# EAGLE design Smartboot Prototype_version_4 (EAGLE 6.2)

## Sheet 1 of 2
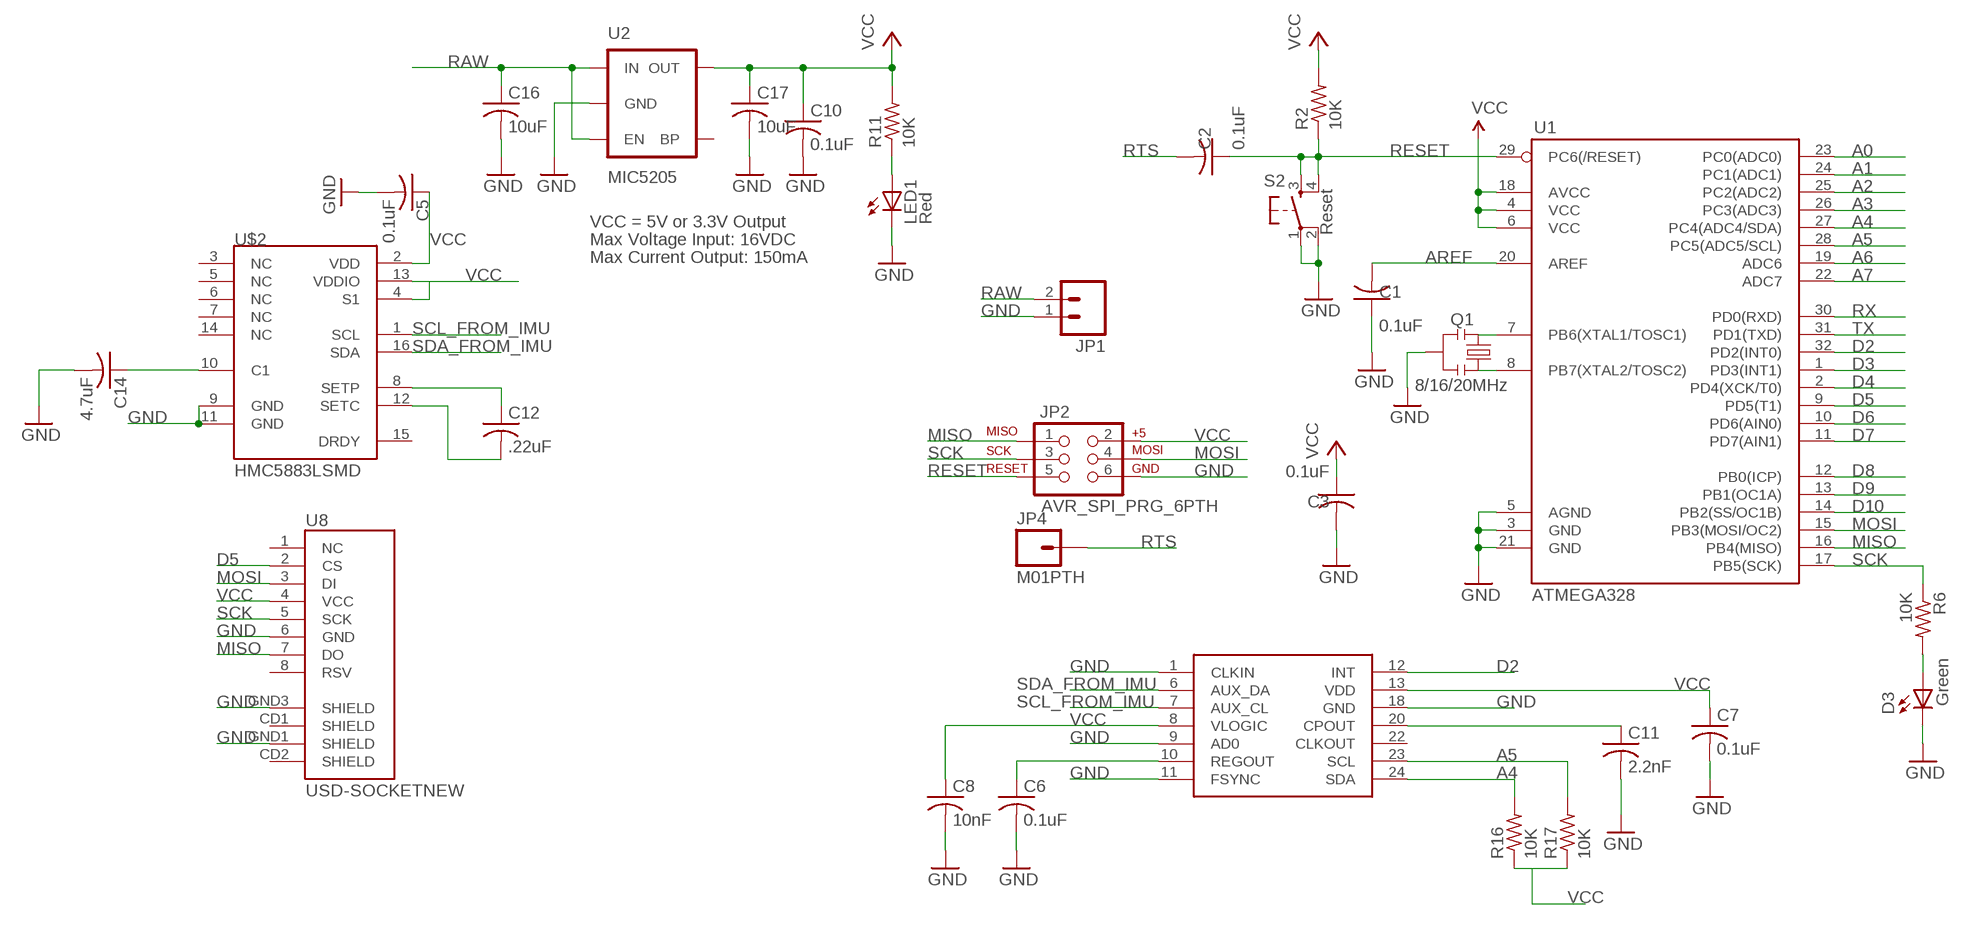
[diagram p0: schematic, sheet 1]

### Parts
C1  0.1uF  C-USC0603  [C0603]
C2  0.1uF  C-USC0603  [C0603]
C3  0.1uF  C-USC0603  [C0603]
C5  0.1uF  C-USC0603  [C0603]
C6  0.1uF  C-USC0603  [C0603]
C7  0.1uF  C-USC0603  [C0603]
C8  10nF  C-USC0603  [C0603]
C10  0.1uF  C-USC0603  [C0603]
C11  2.2nF  C-USC0603  [C0603]
C12  .22uF  C-USC0603  [C0603]
C14  4.7uF  C-USC0603  [C0603]
C16  10uF  C-USC0603  [C0603]
C17  10uF  C-USC0603  [C0603]
D3  Green  LED0603  [LED-0603]
JP1  M02-JST-2MM-SMT  [JST-2-SMD]
JP2  AVR_SPI_PRG_6PTH  [2X3]
JP4  M01PTH  [1X01]
LED1  Red  LED0603  [LED-0603]
Q1  8/16/20MHz  RESONATORSMD  [RESONATOR-SMD]
R2  10K  R-US_R0603  [R0603]
R6  10K  R-US_R0603  [R0603]
R11  10K  R-US_R0603  [R0603]
R16  10K  R-US_R0603  [R0603]
R17  10K  R-US_R0603  [R0603]
S2  Reset  TAC_SWITCHSMD  [TACTILE_SWITCH_SMD]
U1  ATMEGA328  ATMEGA168  [TQFP32-08]
U2  MIC5205  V_REG_LDOSMD  [SOT23-5]
U8  USD-SOCKETNEW  [MICRO-SD-SOCKET-PP]
U$2  HMC5883LSMD  [16LPCC]
U$5  MPU-6050A  [QFN-24-NP]

### Nets
A0: U1.23(PC0(ADC0))
A1: U1.24(PC1(ADC1))
A2: U1.25(PC2(ADC2))
A3: U1.26(PC3(ADC3))
A4: R16.2 U1.27(PC4(ADC4/SDA)) U$5.24(SDA)
A5: R17.2 U1.28(PC5(ADC5/SCL)) U$5.23(SCL)
A6: U1.19(ADC6)
A7: U1.22(ADC7)
AREF: C1.2 U1.20(AREF)
D2: U1.32(PD2(INT0)) U$5.12(INT)
D3: U1.1(PD3(INT1))
D4: U1.2(PD4(XCK/T0))
D5: U1.9(PD5(T1)) U8.2(CS)
D6: U1.10(PD6(AIN0))
D7: U1.11(PD7(AIN1))
D8: U1.12(PB0(ICP))
D9: U1.13(PB1(OC1A))
D10: U1.14(PB2(SS/OC1B))
GND [vcc]: C1.1 C3.2 C5.2 C6.2 C7.2 C8.2 C10.2 C11.2 C14.2 C16.2 C17.2 D3.C JP1.1 JP2.6 LED1.C Q1.2 S2.1 S2.2 U1.3(GND) U1.5(AGND) U1.21(GND) U2.2(GND) U8.6(GND) U8.GND1(SHIELD) U8.GND3(SHIELD) U$2.9(GND) U$2.11(GND) U$5.1(CLKIN) U$5.9(AD0) U$5.11(FSYNC) U$5.18(GND) ; also sheet 2
MISO: JP2.1 U1.16(PB4(MISO)) U8.7(DO)
MOSI: JP2.4 U1.15(PB3(MOSI/OC2)) U8.3(DI)
N$1: Q1.1 U1.8(PB7(XTAL2/TOSC2))
N$2: Q1.3 U1.7(PB6(XTAL1/TOSC1))
N$7: D3.A R6.2
N$8: C12.1 U$2.8(SETP)
N$9: C12.2 U$2.12(SETC)
N$10: C14.1 U$2.10(C1)
N$16: C6.1 U$5.10(REGOUT)
N$21: C11.1 U$5.20(CPOUT)
N$38: LED1.A R11.1
RAW [vcc]: C16.1 JP1.2 U2.1(IN) U2.3(EN) ; also sheet 2
RESET: C2.1 JP2.5 R2.1 S2.3 S2.4 U1.29(PC6(/RESET))
RTS: C2.2 JP4.1 ; also sheet 2
RX: U1.30(PD0(RXD)) ; also sheet 2
SCK: JP2.3 R6.1 U1.17(PB5(SCK)) U8.5(SCK)
SCL_FROM_IMU: U$2.1(SCL) U$5.7(AUX_CL)
SDA_FROM_IMU: U$2.16(SDA) U$5.6(AUX_DA)
TX: U1.31(PD1(TXD)) ; also sheet 2
VCC: C3.1 C5.1 C7.1 C8.1 C10.1 C17.1 JP2.2 R2.2 R11.2 R16.1 R17.1 U1.4(VCC) U1.6(VCC) U1.18(AVCC) U2.5(OUT) U8.4(VCC) U$2.2(VDD) U$2.4(S1) U$2.13(VDDIO) U$5.8(VLOGIC) U$5.13(VDD) ; also sheet 2
Unconnected: U2.4(BP) U8.1(NC) U8.8(RSV) U8.CD1(SHIELD) U8.CD2(SHIELD) U$2.3(NC) U$2.5(NC) U$2.6(NC) U$2.7(NC) U$2.14(NC) U$2.15(DRDY) U$5.22(CLKOUT)

### Notes on the sheet
- VCC = 5V or 3.3V Output
- Max Voltage Input: 16VDC
- Max Current Output: 150mA

## Sheet 2 of 2
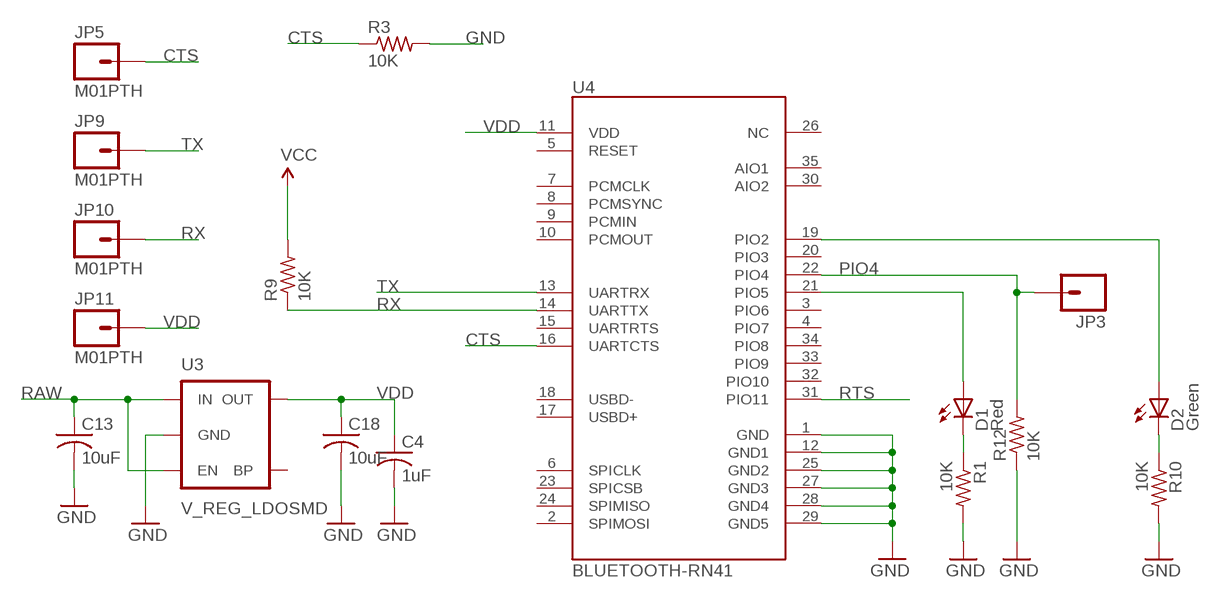
[diagram p1: schematic, sheet 2]

### Parts
C4  1uF  C-USC0603  [C0603]
C13  10uF  C-USC0603  [C0603]
C18  10uF  C-USC0603  [C0603]
D1  Red  LED0603  [LED-0603]
D2  Green  LED0603  [LED-0603]
JP3  M01SMDNS  [1X01NS]
JP5  M01PTH  [1X01]
JP9  M01PTH  [1X01]
JP10  M01PTH  [1X01]
JP11  M01PTH  [1X01]
R1  10K  R-US_R0603  [R0603]
R3  10K  R-US_R0603  [R0603]
R9  10K  R-US_R0603  [R0603]
R10  10K  R-US_R0603  [R0603]
R12  10K  R-US_R0603  [R0603]
U3  V_REG_LDOSMD  [SOT23-5]
U4  BLUETOOTH-RN41  BLUETOOTH-RN41"  [RN41]

### Nets
CTS: JP5.1 R3.1 U4.16(UARTCTS)
D1: D1.C R1.1
D11: D2.C R10.1
GND [vcc]: C4.2 C13.2 C18.2 R1.2 R3.2 R10.2 R12.1 U3.2(GND) U4.1(GND) U4.12(GND1) U4.25(GND2) U4.27(GND3) U4.28(GND4) U4.29(GND5) ; also sheet 1
N$3: D1.A U4.21(PIO5)
N$4: D2.A U4.19(PIO2)
PIO4: JP3.1 R12.2 U4.22(PIO4)
RAW [vcc]: C13.1 U3.1(IN) U3.3(EN) ; also sheet 1
RTS: U4.31(PIO11) ; also sheet 1
RX: JP10.1 R9.1 U4.14(UARTTX) ; also sheet 1
TX: JP9.1 U4.13(UARTRX) ; also sheet 1
VCC: R9.2 ; also sheet 1
VDD: C4.1 C18.1 JP11.1 U3.5(OUT) U4.11(VDD)
Unconnected: U3.4(BP) U4.2(SPIMOSI) U4.3(PIO6) U4.4(PIO7) U4.5(RESET) U4.6(SPICLK) U4.7(PCMCLK) U4.8(PCMSYNC) U4.9(PCMIN) U4.10(PCMOUT) U4.15(UARTRTS) U4.17(USBD+) U4.18(USBD-) U4.20(PIO3) U4.23(SPICSB) U4.24(SPIMISO) U4.26(NC) U4.30(AIO2) U4.32(PIO10) U4.33(PIO9) U4.34(PIO8) U4.35(AIO1)

## Library data of the parts
C1-C8 C10-C14 C16-C18 = resistor:C-US: CAPACITOR, American symbol
D1-D3 LED1 = SparkFun:LED: LEDs Standard schematic elements and footprints for 5mm, 3mm, 1206, and 0603 sized LEDs. 5mm - Spark Fun Electronics SKU : COM-00529 (and others)
JP1 = SparkFun-Connectors:M02: Header 2 Standard 2-pin 0.1" header. Use with straight break away headers (SKU : PRT-00116), right angle break away headers (PRT-00553), swiss pins (PRT-00743), machine pins (PRT-00117), and female headers (PRT-00115). Molex polarized connector foot print use with SKU : PRT-08233 with associated crimp pins and housings.
JP2 = SparkFun-Connectors:AVR_SPI_PRG_6: AVR ISP 6 Pin This is the reduced ISP connector for AVR programming. Common on Arduino. This footprint will take up less PCB space and can be used with a 10-pin to 6-pin adapter such as SKU: BOB-08508
JP3 = SparkFun:M01: Header 1 Standard 1-pin 0.1" header. Use with straight break away headers (SKU : PRT-00116), right angle break away headers (PRT-00553), swiss pins (PRT-00743), machine pins (PRT-00117), and female headers (PRT-00115).
JP4 JP5 JP9-JP11 = SparkFun-Connectors:M01: Header 1 Standard 1-pin 0.1" header. Use with straight break away headers (SKU : PRT-00116), right angle break away headers (PRT-00553), swiss pins (PRT-00743), machine pins (PRT-00117), and female headers (PRT-00115).
Q1 = SparkFun:RESONATOR: Resonator Small SMD resonator. This is the itty bitty 10/20MHz resonators with built in caps. CSTCE10M0G55 and CSTCE20M0V53. Footprint has been reviewed closely but hasn't been tested yet.
R1-R3 R6 R9-R12 R16 R17 = resistor:R-US_: RESISTOR, American symbol
S2 = SparkFun:TAC_SWITCH: Momentary Switch Button commonly used for reset or general input. Spark Fun Electronics SKU : COM-00097
U1 = SparkFun:ATMEGA168
U2 U3 = SparkFun:V_REG_LDO: Voltage Regulator LDO Standard 150mA LDO voltage regulator in SOT-23 layout. Micrel part MIC5205. BP (by-pass) pin is used to lower output noise with 470pF cap.
U4 = ScratchPad:BLUETOOTH-RN41
U8 = SparkFun-Connectors:USD-SOCKET: microSD Socket Push-push type uSD socket. Schematic element and footprint production proven. Spark Fun Electronics SKU : PRT-00127. tDoc lines correctly indicate media card edge positions when inserting (unlocked, locked, depressed).
U$2 = SparkFun-Sensors:HMC5883L: 3 Axis Digital Compass IC
U$5 = SparkFun-Sensors:MPU-6050A

## Net classes
0 default: width 0.203 mm
1 vcc: width 0.254 mm

## Board
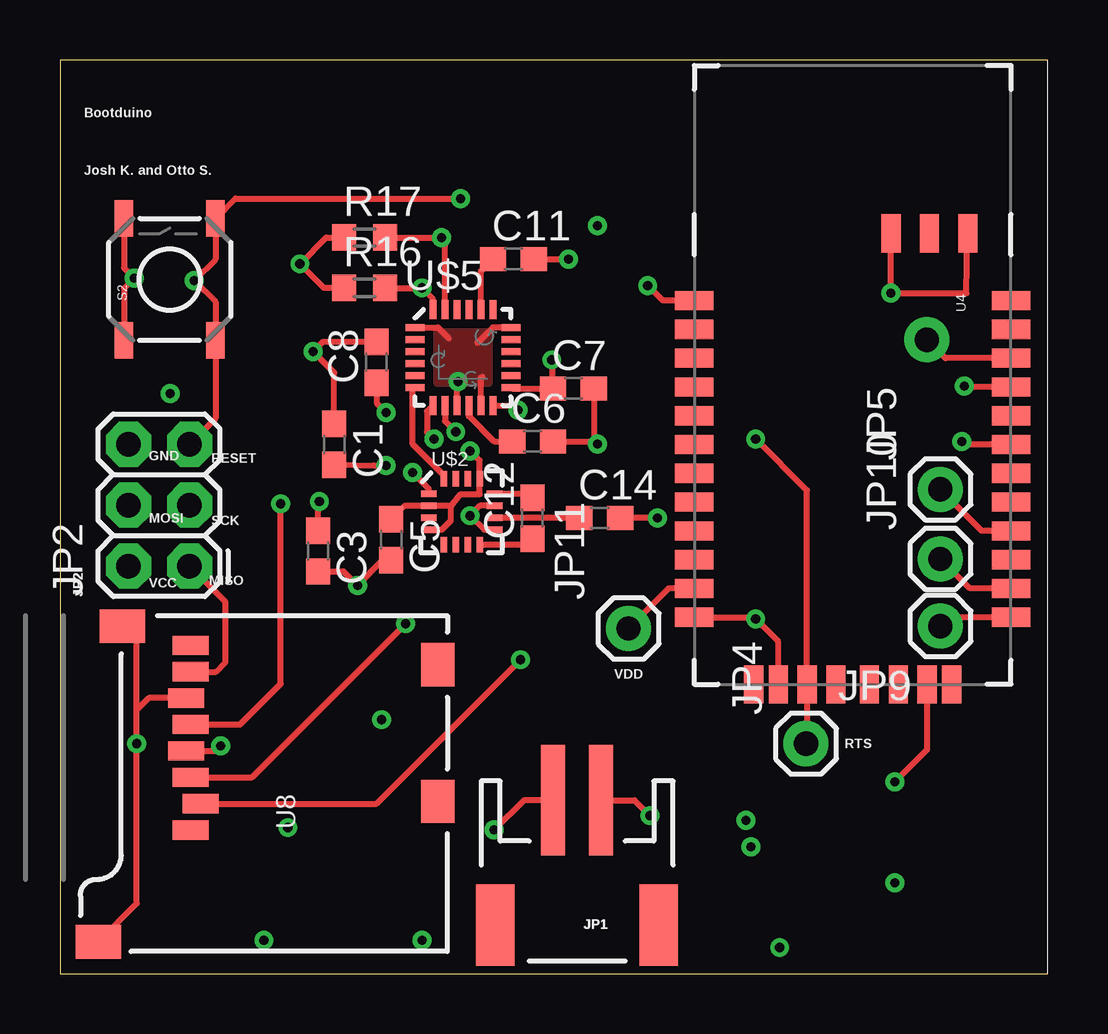
[diagram p2: board, top side]
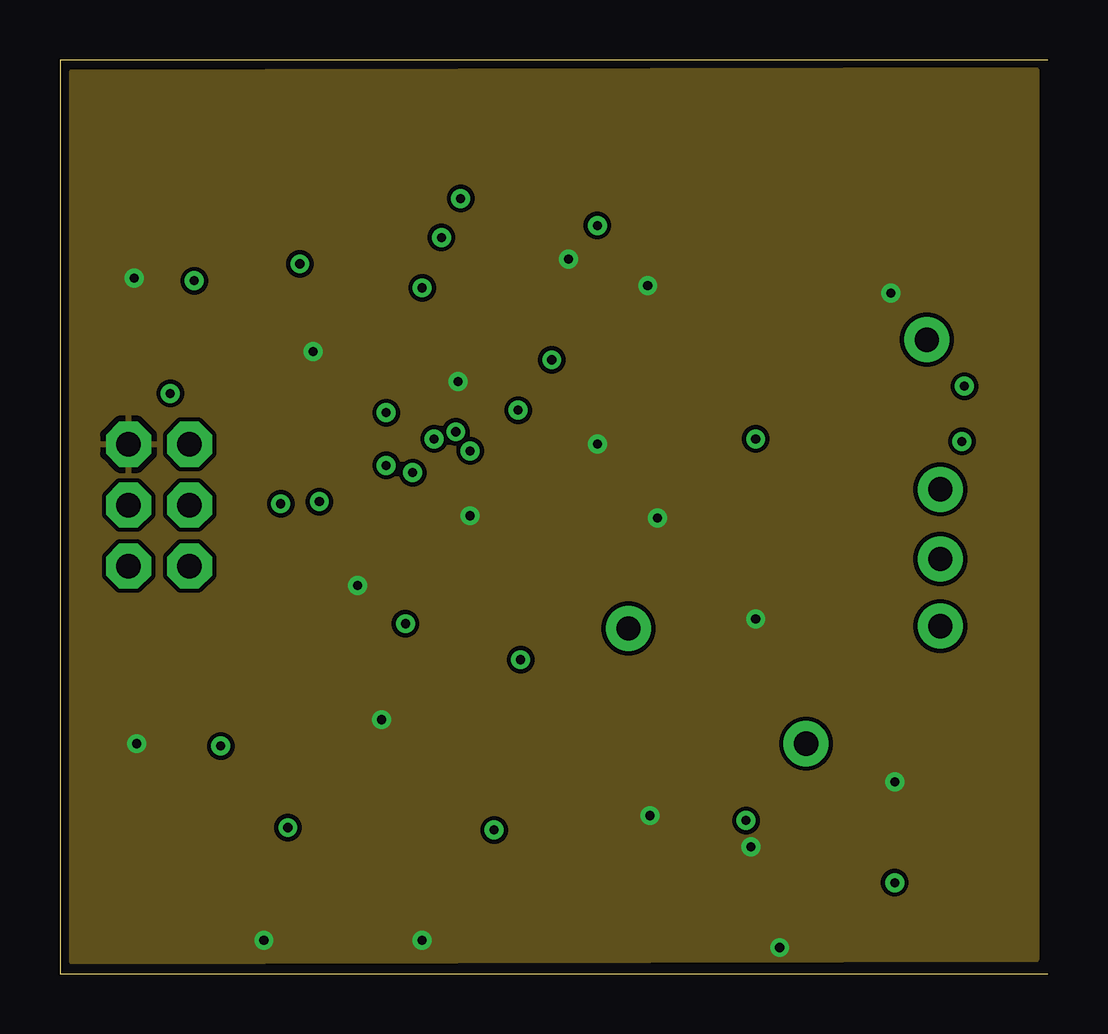
[diagram p3: board, inner layer Route2]
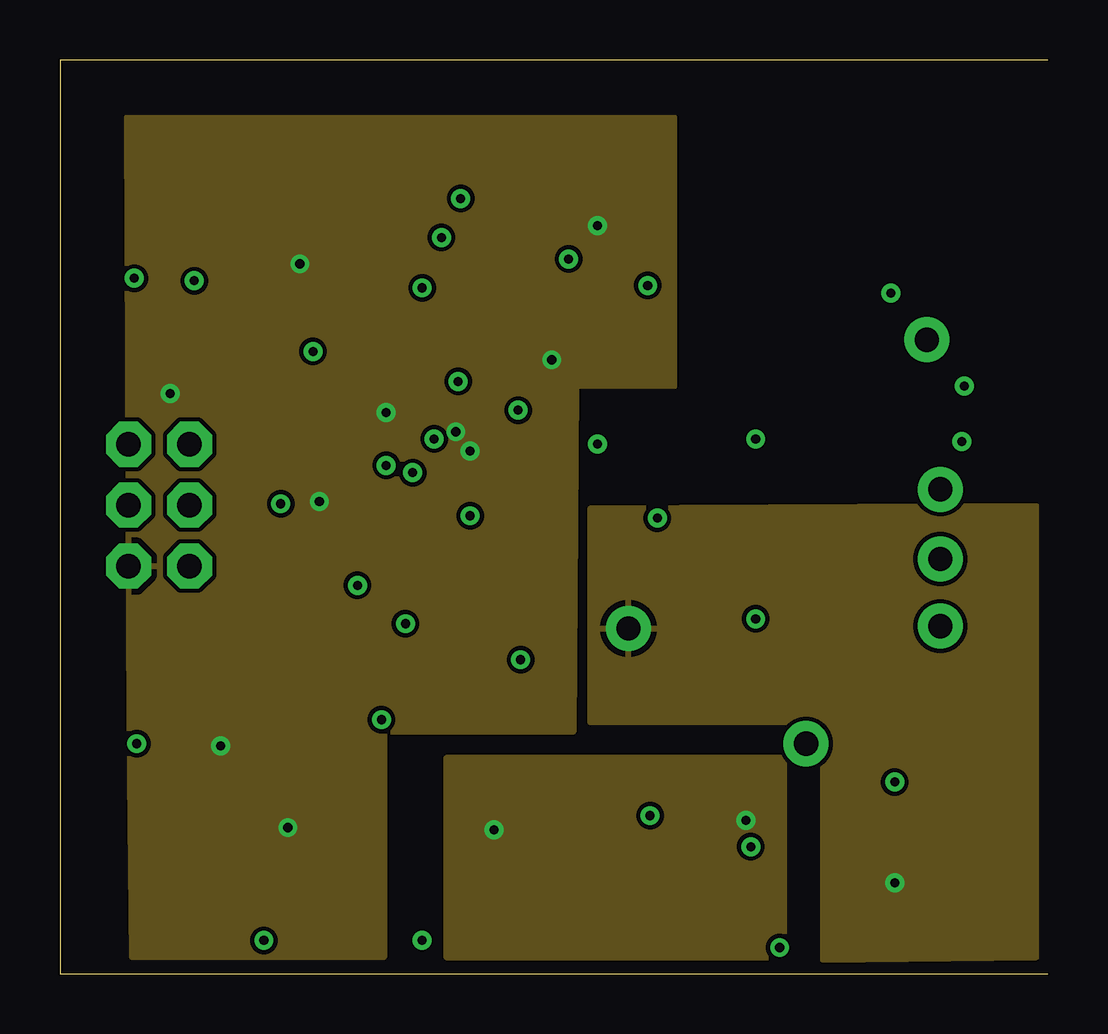
[diagram p4: board, inner layer Route15]
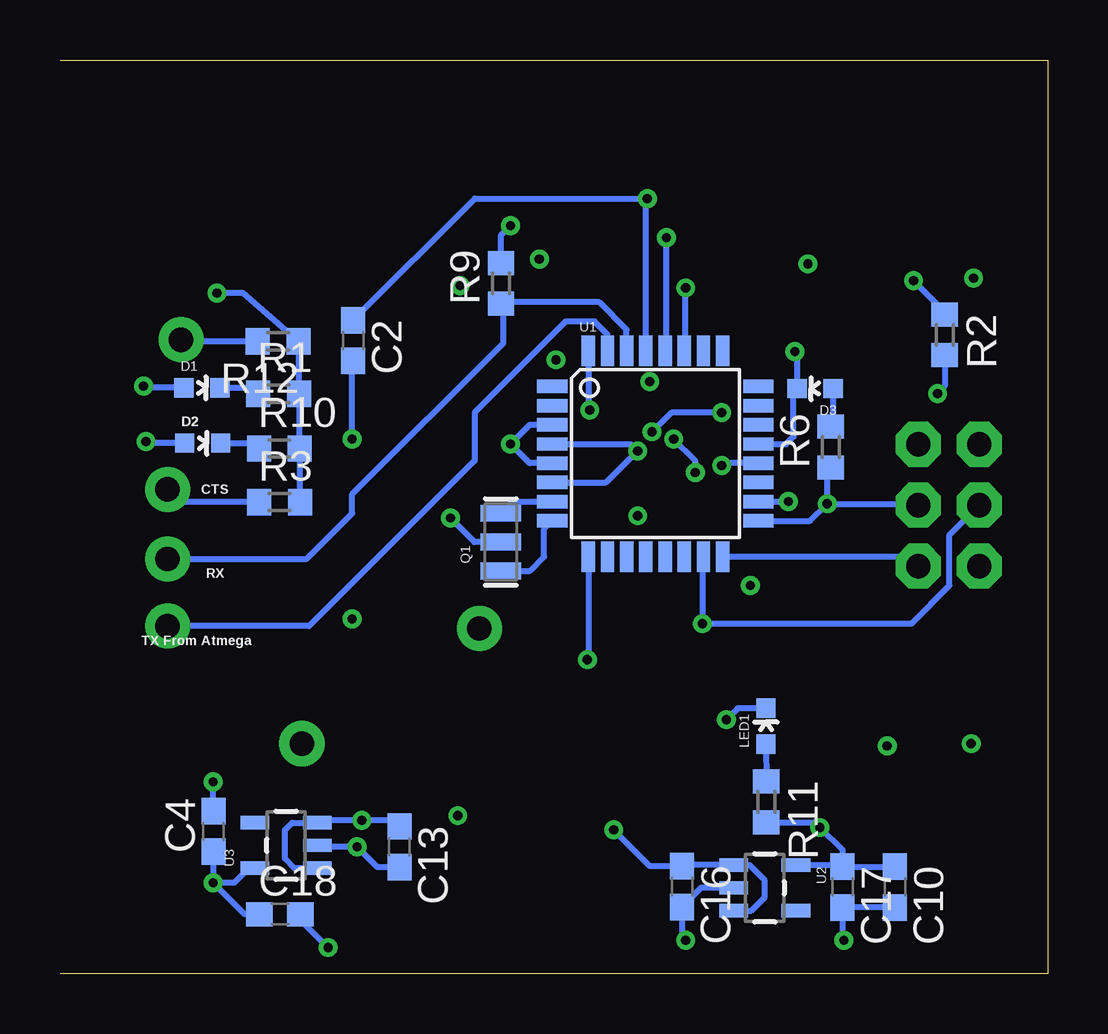
[diagram p5: board, bottom side, seen from below]

Size 41.18 x 38.1 mm. Coordinates in mm from the lower left corner, seen from the top.
Outline: 41.18,0 0,0 0,38.1 41.18,38.1
Copper layers (1*2+15*16): Top 0.035mm / dielectric 25mil / Route2 0.035mm / dielectric 25mil / Route15 0.035mm / dielectric 25mil / Bottom 0.035mm
Design rules: minimum track width 7mil, minimum drill 15mil, track to track 7mil, track to pad 6mil, pad to pad 6mil, via to via 6mil, smd to smd 6mil, copper to edge 10mil, drill to drill 10mil, minimum pad ring 10mil, minimum via ring 8mil, stop-mask expansion 4mil, vias tented up to drill 0mil, thermal gap 10mil

### Footprints (pad centres in the part's own frame; a part is rotated, then mirrored left to right if it is on the bottom)
C0603 = smd 1.1 x 1: 1 -0.85,0; 2 0.85,0
LED-0603 = smd 0.8 x 0.8: A 0,-0.75; C 0,0.75
JST-2-SMD = smd 1 x 4.6: 1 -1,-3.7; 2 1,-3.7 | smd 1.6 x 3.4: NC1 -3.4,1.5; NC2 3.4,1.5
2X3 = drill 1.016 pad 1.88 octagon: 1 0,0; 2 0,2.54; 3 2.54,0; 4 2.54,2.54; 5 5.08,0; 6 5.08,2.54
1X01NS = drill 1.016 pad 1.88: 1 0,0
1X01 = drill 1.016 pad 1.88: 1 0,0
RESONATOR-SMD = smd 0.7 x 1.7: 1 -1.2,0; 2 0,0; 3 1.2,0
R0603 = smd 1 x 1.1: 1 -0.85,0; 2 0.85,0
TACTILE_SWITCH_SMD = smd 1.524 x 0.762: 1 -2.54,1.905; 2 2.54,1.905; 3 -2.54,-1.905; 4 2.54,-1.905
TQFP32-08 = smd 1.27 x 0.559: 1 -4.293,2.8; 2 -4.293,2; 3 -4.293,1.2; 4 -4.293,0.4; 5 -4.293,-0.4; 6 -4.293,-1.2; 7 -4.293,-2; 8 -4.293,-2.8; 17 4.293,-2.8; 18 4.293,-2; 19 4.293,-1.2; 20 4.293,-0.4; 21 4.293,0.4; 22 4.293,1.2; 23 4.293,2; 24 4.293,2.8 | smd 0.559 x 1.27: 9 -2.8,-4.293; 10 -2,-4.293; 11 -1.2,-4.293; 12 -0.4,-4.293; 13 0.4,-4.293; 14 1.2,-4.293; 15 2,-4.293; 16 2.8,-4.293; 25 2.8,4.293; 26 2,4.293; 27 1.2,4.293; 28 0.4,4.293; 29 -0.4,4.293; 30 -1.2,4.293; 31 -2,4.293; 32 -2.8,4.293
SOT23-5 = smd 0.55 x 1.2: 1 -0.95,-1.3; 2 0,-1.3; 3 0.95,-1.3; 4 0.95,1.3; 5 -0.95,1.3
RN41 = smd 0.8 x 1.6: 1 -6.6,-6.6; 2 -5.4,-6.6; 3 -4.2,-6.6; 4 -3,-6.6; 5 -1.8,-6.6; 6 -0.6,-6.6; 7 0.6,-6.6; 8 1.8,-6.6; 9 3,-6.6; 10 4.2,-6.6; 11 5.4,-6.6; 12 6.6,-6.6; 13 6.6,6.6; 14 5.4,6.6; 15 4.2,6.6; 16 3,6.6; 17 1.8,6.6; 18 0.6,6.6; 19 -0.6,6.6; 20 -1.8,6.6; 21 -3,6.6; 22 -4.2,6.6; 23 -5.4,6.6; 24 -6.6,6.6 | smd 1.6 x 0.8: 25 -9.4,4.8; 26 -9.4,3.2; 27 -9.4,1.6; 28 9.4,3.1; 29 9.4,-3.1; 30 9.4,-4.122; 31 9.4,-1.9; 32 9.4,-0.7; 33 9.4,0.7; 34 9.4,1.9; 35 9.4,4.122
MICRO-SD-SOCKET-PP = smd 0.8 x 1.5: 1 -8.94,10.7; 2 -7.84,10.3; 3 -6.74,10.7; 4 -5.64,10.9; 5 -4.54,10.7; 6 -3.44,10.9; 7 -2.34,10.7; 8 -1.24,10.7 | smd 1.8 x 1.4: CD1 -2.05,0.4; CD2 -7.75,0.4 | smd 1.4 x 1.9: GND1 -13.6,14.55; GND3 -0.45,13.55
16LPCC = smd 0.65 x 0.28: 1 -1.37,0.75; 2 -1.37,0.25; 3 -1.37,-0.25; 4 -1.37,-0.75; 9 1.37,-0.75; 10 1.37,-0.25; 11 1.37,0.25; 12 1.37,0.75 | smd 0.28 x 0.65: 5 -0.75,-1.37; 6 -0.25,-1.37; 7 0.25,-1.37; 8 0.75,-1.37; 13 0.75,1.37; 14 0.25,1.37; 15 -0.25,1.37; 16 -0.75,1.37
QFN-24-NP = smd 0.8 x 0.3: 1 -2,1.25; 2 -2,0.75; 3 -2,0.25; 4 -2,-0.25; 5 -2,-0.75; 6 -2,-1.25; 13 2,-1.25; 14 2,-0.75; 15 2,-0.25; 16 2,0.25; 17 2,0.75; 18 2,1.25 | smd 0.3 x 0.8: 7 -1.25,-2; 8 -0.75,-2; 9 -0.25,-2; 10 0.25,-2; 11 0.75,-2; 12 1.25,-2; 19 1.25,2; 20 0.75,2; 21 0.25,2; 22 -0.25,2; 23 -0.75,2; 24 -1.25,2

### Placement (x,y rotation side)
C1  11.43,22.08 270 top
C2  28.96,26.4 270 bottom
C3  10.75,17.63 270 top
C4  34.78,5.94 90 bottom
C5  13.8,18.1 270 top
C6  19.7,22.2 0 top
C7  21.4,24.4 0 top
C8  13.2,25.5 90 top
C10  6.38,3.62 270 bottom
C11  18.9,29.8 0 top
C12  19.7,19 90 top
C13  27.04,5.3 270 bottom
C14  22.5,19 0 top
C16  15.25,3.64 270 bottom
C17  8.57,3.62 270 bottom
C18  32.01,2.49 0 bottom
D1  35.26,24.44 270 bottom
D2  35.24,22.13 270 bottom
D3  9.7,24.4 90 bottom
JP1  21.55,3.54 180 top
JP2  5.4,17 90 top
JP3  36.14,26.44 270 top
JP4  31.1,9.6 90 top
JP5  36.7,20.2 90 top
JP9  36.7,14.5 180 top
JP10  36.7,17.3 90 top
JP11  23.7,14.4 90 top
LED1  11.75,10.33 0 bottom
Q1  22.81,18 90 bottom
R1  32.07,24.18 0 bottom
R2  4.3,26.64 270 bottom
R3  32.03,19.67 0 bottom
R6  9.05,21.97 90 bottom
R9  22.8,28.79 90 bottom
R10  32.04,21.9 0 bottom
R11  11.74,7.17 270 bottom
R12  32.09,26.37 180 bottom
R16  12.7,28.6 0 top
R17  12.7,30.7 0 top
S2  4.57,28.95 90 top
U1  16.36,21.69 0 bottom
U2  11.8,3.59 270 bottom
U3  31.76,5.36 90 bottom
U4  33.04,21.47 270 top
U8  16.16,14.94 90 top
U$2  16.75,19.27 0 top
U$5  16.8,25.7 0 top

### Tracks (layer width: path | path; a pad name or v marks a point on that pad's centre or on a via)
A4  (via drill 0.38)
  Top 0.254: U$5.24 15.55,28.15 v15.1,28.6 R16.2
  Bottom 0.254: U1.27 15.1,26.04 v15.1,28.6
A5  (via drill 0.38)
  Top 0.254: U$5.23 16.05,30.55 v15.9,30.7 R17.2
  Bottom 0.254: U1.28 15.9,26.04 v15.9,30.7
AREF  (via drill 0.38)
  Top 0.254: C1.2 13.09,21.2 v13.6,21.2
  Bottom 0.254: U1.20 13.51,21.29 v13.6,21.2
CTS
  Top 0.254: U4.16 38.43,18.47 JP5.1
  Bottom 0.254: R3.1 36.16,19.66 JP5.1
D1
  Bottom 0.254: D1.C 33.17,24.44 R1.1
D2  (via drill 0.38)
  Top 0.254: U$5.12 18.9,23.7 v19.1,23.5
  Bottom 0.254: U1.32 19.16,23.56 v19.1,23.5
D5  (via drill 0.38)
  Top 0.254: U8.2 13.2,7.1 v19.2,13.1
  Bottom 0.254: U1.9 19.16,13.14 v19.2,13.1
D11
  Bottom 0.254: D2.C 33.12,22.13 R10.1
GND  (via drill 0.38)
  Top 0.254: U4.25 37.82,30.74 37.79,28.38 v34.64,28.38 | v34.64,28.38 U4.27 | v34.64,28.38 | 26.31,15 U4.12 28.93,14.87 v29,14.8 29.94,13.86 U4.29 | U8.GND1 3.2,2.94 v3.2,9.6 3.2,11 | 3.2,11 3.2,13.89 U8.GND3 | U8.6 3.7,11.5 3.2,11 | S2.2 2.67,29.43 v3.1,29 2.67,28.57 S2.1 | C7.2 22.25,22.25 v22.41,22.09 22.3,22.2 C6.2 | U$2.11 17.52,19.52 v17.1,19.1 17.68,18.52 U$2.9 | v24.9,19 C14.2 | U$5.9 16.55,24.65 v16.6,24.7 | C8.2 10.95,26.35 v10.55,25.95 11.43,25.07 C1.1 | C3.2 11.82,16.78 v12.4,16.2 13.45,17.25 C5.2 | C11.2 v21.2,29.8 | U$5.1 15.75,26.95 16.2,26.5 | U$5.18 18.05,26.95 17.4,26.3 | U$5.11 17.55,24.85 17.6,24.9 | U4.1 25.13,28.07 v24.5,28.7 | U4.28 36.14,9.34 v34.8,8 | JP1.1 23.96,7.24 v24.6,6.6
  Bottom 0.254: v34.64,28.38 33.54,28.38 R12.1 31.22,26.35 R1.2 31.19,24.16 R10.2 31.18,21.89 R3.2 | U1.5 21.6,21.29 v22.41,22.09 21.61,22.89 U1.3 | U1.21 10.91,22.09 10.6,22.4 10.6,24.35 D3.C 10.45,25.85 v10.55,25.95 | C4.2 34.8,6.81 v34.8,8 | C18.2 31.16,2.26 v30,1.1 | Q1.2 23.9,18 v24.9,19 | U2.2 14.45,3.59 C16.2 15.25,1.55 v15.1,1.4 | C10.2 C17.2 8.57,1.47 v8.5,1.4 | C13.2 27.95,4.45 v28.8,5.3 30.39,5.3 U3.2 | LED1.C 12.92,11.08 v13.4,10.6
  pour Route2: 0.51,0.51 0.51,37.59 40.69,37.69 40.69,0.61
  pour Top: 15.7,26.8 17.9,26.8 17.9,24.6 15.7,24.6
MISO
  Top 0.254: U8.7 6.5,12.6 6.9,13 6.9,15.5 JP2.1
  Bottom 0.254: U1.16 5.8,17.4 JP2.1
MOSI  (via drill 0.38)
  Top 0.254: U8.3 8,8.2 v14.4,14.6
  Bottom 0.254: U1.15 14.4,17.36 v14.4,14.6 5.7,14.6 4.1,16.2 4.1,18.3 JP2.4
N$1
  Bottom 0.254: Q1.1 21.6,16.8 21,17.4 21,18.54 U1.8
N$2
  Bottom 0.254: 20.74,19.6 U1.7 22.32,19.69 Q1.3
N$3  (via drill 0.38)
  Top 0.254: U4.21 37.73,24.47 v37.7,24.5
  Bottom 0.254: D1.A 37.64,24.44 v37.7,24.5
N$4  (via drill 0.38)
  Top 0.254: U4.19 37.73,22.07 v37.6,22.2
  Bottom 0.254: D2.A 37.53,22.13 v37.6,22.2
N$7
  Bottom 0.254: R6.2 8.95,22.82 D3.A
N$8
  Top 0.254: U$2.8 19.45,17.9 C12.1
N$9
  Top 0.254: U$2.12 19.53,20.02 C12.2
N$10
  Top 0.254: U$2.10 21.63,19.02 C14.1
N$16
  Top 0.254: U$5.10 17.05,23.25 18.1,22.2 C6.1
N$21
  Top 0.254: U$5.20 17.55,29.3 C11.1
N$38
  Bottom 0.254: LED1.A R11.1
PIO4
  Top 0.254: U4.22 36.91,25.67 JP3.1
  Bottom 0.254: R12.2 36.06,26.37 JP3.1
RAW  (via drill 0.38)
  Top 0.254: JP1.2 19.34,7.24 v18.1,6
  Bottom 0.254: U3.1 31.41,4.41 31.8,4.8 31.8,6 31.5,6.3 U3.3 30.37,6.4 v28.6,6.4 27.29,6.4 C13.1 | U2.3 12.36,2.64 11.8,3.2 11.8,3.9 12.44,4.54 U2.1 15.2,4.54 C16.1 16.59,4.49 v18.1,6
  pour Route15: 16.1,0.7 30.2,0.7 30.2,9 16.1,9
RESET  (via drill 0.38)
  Top 0.254: v16.7,32.32 7.31,32.32 S2.4 6.48,29.78 v5.6,28.9 6.48,28.02 S2.3 6.48,23.16 JP2.5
  Bottom 0.254: U1.29 16.76,32.26 v16.7,32.32 23.89,32.32 C2.1 | R2.1 4.3,27.6 v5.6,28.9
RTS  (via drill 0.38)
  Top 0.254: v29,22.3 31.14,20.16 U4.31 31.14,9.64 JP4.1
  Bottom 0.254: v29,22.3 29,25.51 C2.2
RX
  Top 0.254: U4.14 37.93,16.07 JP10.1
  Bottom 0.254: U1.30 17.56,26.86 18.7,28 22.74,28 R9.1 22.7,27.85 22.7,26.3 29,20 29,19.2 30.9,17.3 JP10.1
SCK  (via drill 0.38)
  Top 0.254: U8.5 7.5,10.4 9.2,12.1 v9.2,19.6
  Bottom 0.254: v9.2,19.6 9.2,21.07 R6.1 | U1.17 9.91,18.89 v9.2,19.6 | v9.2,19.6 5.46,19.6 JP2.3
SCL_FROM_IMU  (via drill 0.38)
  Top 0.254: U$2.1 15.38,20.23 v14.7,20.9 | U$5.7 15.3,23.45 15.3,22.6 v15.6,22.3
  Bottom 0.254: v14.7,20.9 14.7,21.4 v15.6,22.3
SDA_FROM_IMU
  Top 0.254: U$2.16 15.99,20.8 14.7,22.1 14.7,24.35 U$5.6
TX
  Top 0.254: U4.13 37.07,14.87 JP9.1
  Bottom 0.254: U1.31 18.36,26.66 18.9,27.2 20.1,27.2 23.9,23.4 23.9,21.4 30.8,14.5 JP9.1
VCC  (via drill 0.38)
  Top 0.254: U8.4 6.5,9.3 v6.7,9.5 | U$5.8 16.05,23.05 v16.5,22.6 | U$5.13 18.85,24.4 C7.1 20.5,24.45 v20.5,25.6 | C8.1 13.2,23.8 v13.6,23.4 | 10.7,18.53 C3.1 10.75,19.63 v10.81,19.69 | R16.1 11,28.6 v10,29.6 11.1,30.7 R17.1 | 16.3,19.5 16.7,20 17.4,20 17.5,20 U$2.13 17.5,21.41 v17.1,21.8 | U$2.4 15.92,18.52 16.3,18.9 16.3,19.5 | C5.1 14.37,19.52 U$2.2 16.28,19.52 16.3,19.5
  Bottom 0.254: R2.2 4.3,24.5 v4.6,24.2 | v13.6,23.4 15.7,23.4 v16.5,22.6 | U1.18 v10.81,19.69 | C17.1 C10.1 | U2.5 8.63,4.54 C17.1 | R9.2 22.8,30.8 v22.4,31.2 | R11.2 9.72,6.32 v9.5,6.1 8.57,5.17 C17.1 | U1.6 18.41,20.49 v17.1,21.8 17.39,22.09 U1.4
  pour Route15: 21.4,10.1 13.5,10.1 13.5,0.7 3,0.7 2.9,10.1 2.8,35.7 25.6,35.7 25.6,24.5 21.5,24.5
VDD  (via drill 0.38)
  Top 0.254: U4.11 25.37,16.07 JP11.1
  Bottom 0.254: U3.5 33.18,4.54 33.92,3.8 v34.8,3.8 | v34.8,3.8 34.78,3.82 C4.1 | C18.1 33.49,2.49 v34.8,3.8
  pour Route15: 31.8,0.6 40.7,0.7 40.7,19.5 22.1,19.4 22.1,10.5 31.8,10.5

### Text on the board
_tsilk: Bootduino | Josh K. and Otto S. | GND | RESET | MOSI | SCK | VCC | MISO | VDD | RTS
_bsilk: CTS | RX | TX From Atmega
_tNames: JP2 | JP2 | JP1 | JP1
_bNames: D2